# Altium project Sensor_Mount_Project.PrjPCB
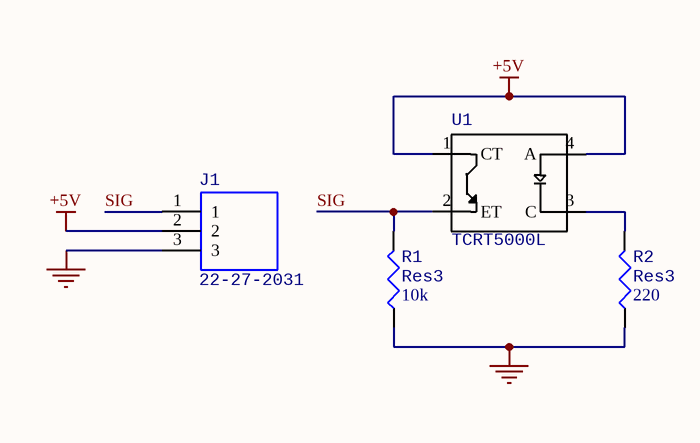
[diagram p0: Sensor Schematic.SchDoc]
1 sheet, 4 parts. Net scope: global (net labels, ports and power ports of the same name join across sheets).
Board file: Sensor PCB.PcbDoc

## Sheet Sensor Schematic.SchDoc
size A4

### Parts
J1  22-27-2031  [SHDR3W64P0X254_1X3_762X580X1170P]
R1  Res3  value 10k  [J1-0603]
R2  Res3  value 220  [J1-0603]
U1  TCRT5000L  [XDCR_TCRT5000L]

### Nets
+5V: J1.2 U1.1(CT) U1.4(A)
GND: J1.3 R1.1 R2.1
SIG: J1.1 R1.2 U1.2(ET)
NetR2_2: R2.2 U1.3(C)

### Library data of the parts
J1 = 22-27-2031: 3way straight PCB header w/friction lock Molex KK Series, Series Number 6410, 2.54mm Pitch 3 Way 1 Row Straight PCB Header, Solder Termination, 4A; Allied_Number: 70190935; Geometry.Height: 11.7mm; RS Part Number: 1707102; Manufacturer_Name: Molex; Manufacturer_Part_Number: 22-27-2031; Datasheet Link: http://uk.rs-online.com/web/p/products/1707102
R1 R2 = Res3: Resistor; Published: 8-Jun-2000; LatestRevisionDate: 29-May-2009; LatestRevisionNote: IPC-7351 Footprint Added.; PackageReference: J1-0603; Publisher: Altium Limited; PackageDescription: Chip Resistor
U1 = TCRT5000L: TCRT5000 Series 940 nm 100 mA 60 mA Transistor Output Reflective Optical Sensor; MF: Vishay Semiconductor; Price: 0.64 USD; SnapEDA_Link: https://www.snapeda.com/parts/TCRT5000L/Vishay%20Semiconductor%20Opto%20Division/view-part/?ref=snap; MP: TCRT5000L; Package: PCB Mount Vishay; Availability: Good; Value: *